# EAGLE design snap_v1 (EAGLE 7.6.0)
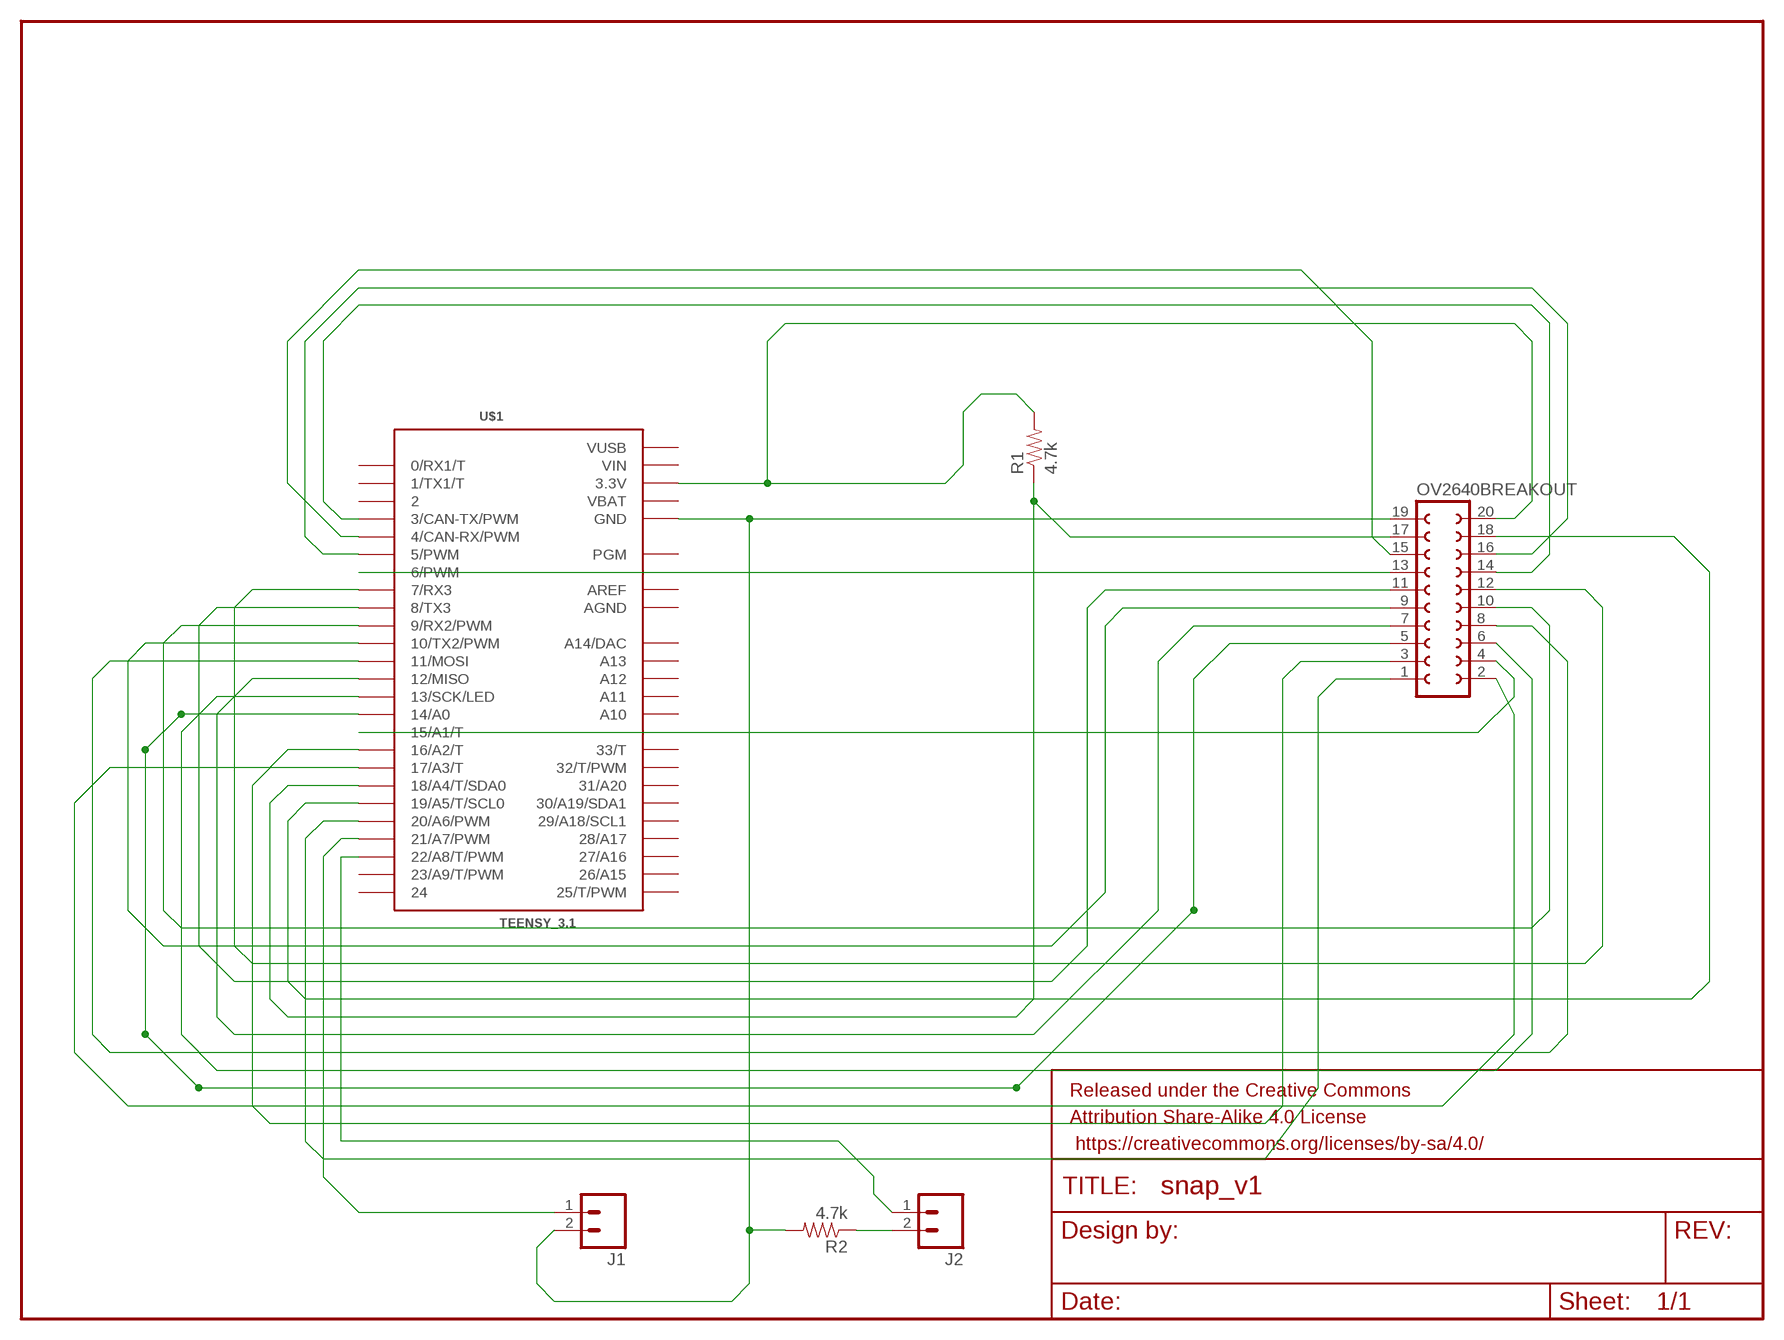
[diagram p0: schematic, sheet 1]

## Parts
FRAME1  FRAME-LETTER  [CREATIVE_COMMONS]
J1  M02PTH  [1X02]
J2  M02PTH  [1X02]
OV2640BREAKOUT  FE10-2  [FE10-2]
R1  4.7k  RESISTOREZ  [AXIAL-0.3EZ]
R2  4.7k  RESISTOREZ  [AXIAL-0.3EZ]
U$1  TEENSY_3.1  TEENSY_3.1-3.2_ALL_PINS&PADS  [TEENSY_3.0-3.2_ALL_PINS_&_PADS]

## Nets
D0: OV2640BREAKOUT.6 U$1.13(13/SCK/LED)
D1: OV2640BREAKOUT.5 U$1.14/A0
D2: OV2640BREAKOUT.8 U$1.11(11/MOSI)
D3: OV2640BREAKOUT.7 U$1.12(12/MISO)
D4: OV2640BREAKOUT.10 U$1.9(9/RX2/PWM)
D5: OV2640BREAKOUT.9 U$1.10(10/TX2/PWM)
D6: OV2640BREAKOUT.12 U$1.7(7/RX3)
D7: OV2640BREAKOUT.11 U$1.8(8/TX3)
HREF: OV2640BREAKOUT.16 U$1.5(5/PWM)
N$2: OV2640BREAKOUT.17 R1.P$1 U$1.18/A4(18/A4/T/SDA0)
N$3: J2.2 R2.P$1
PCLK: OV2640BREAKOUT.13 U$1.6(6/PWM)
PWDN: OV2640BREAKOUT.2 U$1.17/A3(17/A3/T)
RST: OV2640BREAKOUT.1 U$1.20/A6(20/A6/PWM)
SCLK: OV2640BREAKOUT.18 U$1.19/A5(19/A5/T/SCL0)
STATUSLED: J1.1 U$1.21/A7(21/A7/PWM)
STATUSLEDGND: J1.2 OV2640BREAKOUT.19 R2.P$2 U$1.GND U$1.GND1(GND) U$1.GND2(GND)
SWITCH: J2.1 U$1.22/A8(22/A8/T/PWM)
VCCPULLUP: OV2640BREAKOUT.20 R1.P$2 U$1.3.3V U$1.3.3V1(3.3V) U$1.3.3V2(3.3V)
VSYNC: OV2640BREAKOUT.15 U$1.4(4/CAN-RX/PWM)
XCLK: OV2640BREAKOUT.14 U$1.3(3/CAN-TX/PWM)
Y0: OV2640BREAKOUT.4 U$1.15/A1(15/A1/T)
Y1: OV2640BREAKOUT.3 U$1.16/A2(16/A2/T)
Unconnected: U$1.0(0/RX1/T) U$1.1(1/TX1/T) U$1.2 U$1.23/A9(23/A9/T/PWM) U$1.24 U$1.25(25/T/PWM) U$1.26(26/A15) U$1.27(27/A16) U$1.28(28/A17) U$1.29(29/A18/SCL1) U$1.30(30/A19/SDA1) U$1.31(31/A20) U$1.32(32/T/PWM) U$1.33(33/T) U$1.A10 U$1.A11 U$1.A12 U$1.A13 U$1.PGM U$1.RESET/DAC(A14/DAC)

## Power pins joined to a net without a drawn wire
AGND: U$1.AGND
AREF: U$1.AREF
VBAT: U$1.VBAT
VIN: U$1.VIN
VUSB: U$1.VUSB

## Library data of the parts
FRAME1 = SparkFun-Aesthetics:FRAME-LETTER: Schematic Frame Standard 8.5x11 US Letter frame
J1 J2 = SparkFun-Connectors:M02: Standard 2-pin 0.1" header. Use with - straight break away headers ( PRT-00116) - right angle break away headers (PRT-00553) - swiss pins (PRT-00743) - machine pins (PRT-00117) - female headers (PRT-00115) Molex polarized connector foot print use with: PRT-08233 with associated crimp pins and housings. 2.54_SCREWTERM for use with PRT-10571. 3.5mm Screw Terminal footprints for PRT-08084 5mm Screw Terminal footprints for use with PRT-08432
OV2640BREAKOUT = con-lsta:FE10-2: FEMALE HEADER; OC_FARNELL: unknown; OC_NEWARK: unknown
R1 R2 = SparkFun-Resistors:RESISTOR: Resistor Basic schematic elements and footprints for 0603, 1206, and PTH resistors.
U$1 = teensy:TEENSY_3.1-3.2_ALL_PINS&PADS: Footprint for Teensy 3.1 or 3.2 board using all pads and all through-holes. Pads need a 2x7 0.1" SMD header.

## Board
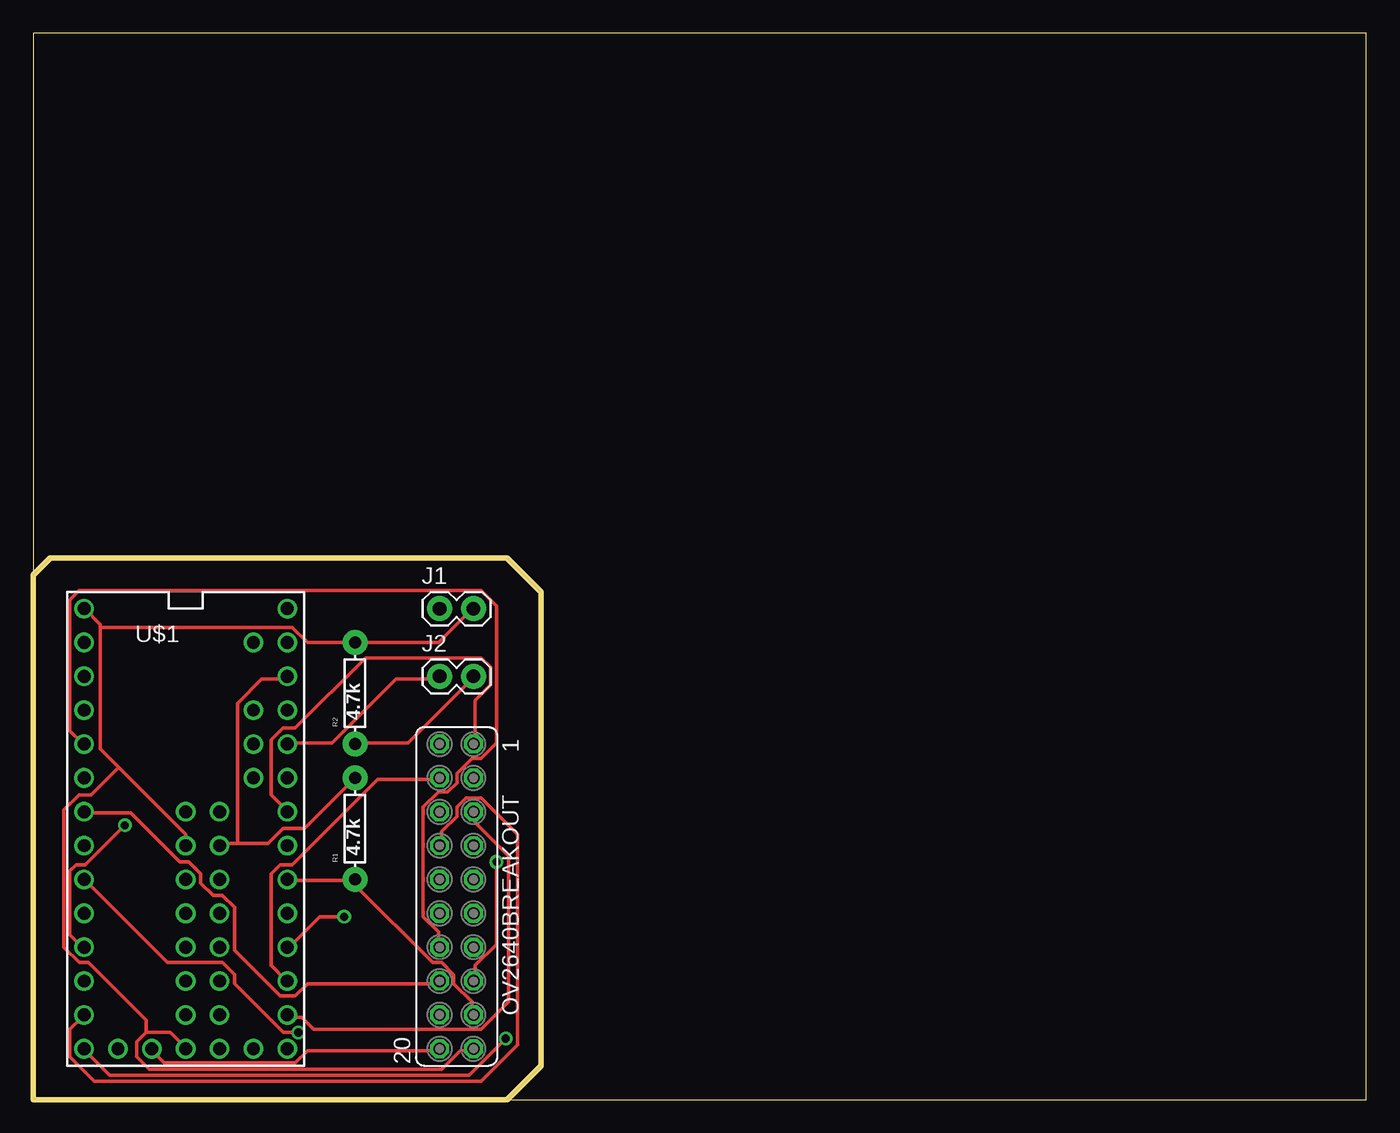
[diagram p1: board, top side]
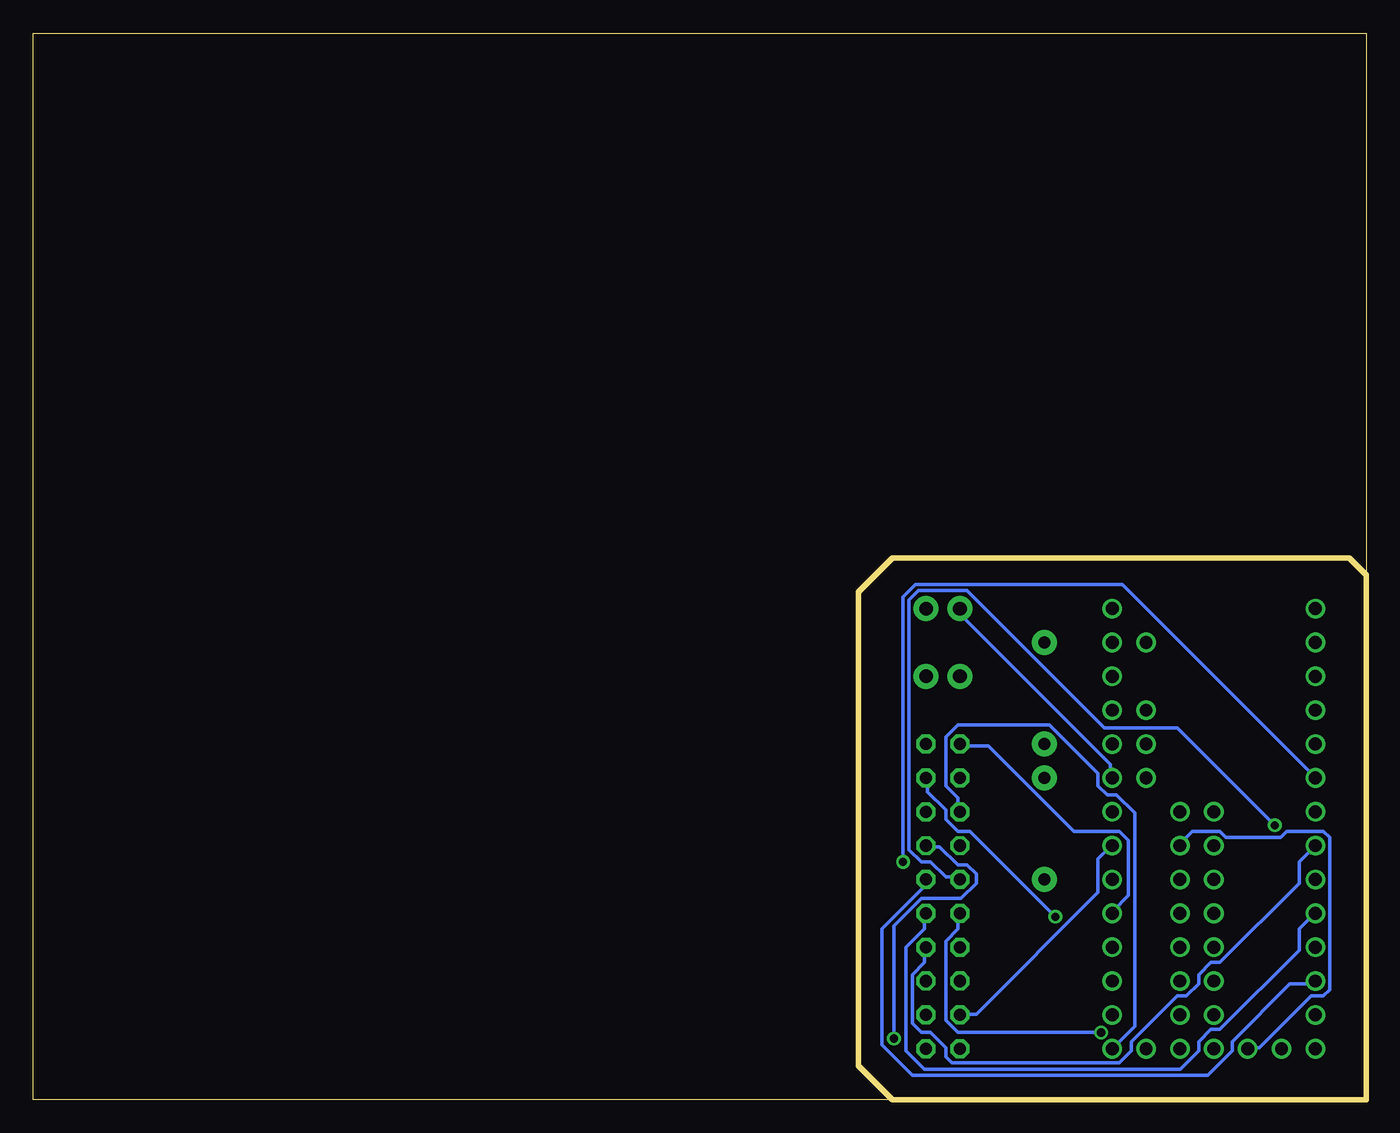
[diagram p2: board, bottom side, seen from below]

Size 100 x 80 mm. Coordinates in mm from the lower left corner, seen from the top.
Outline: 0,0 100,0 100,80 0,80 0,0
Copper layers (1*16): Top 0.035mm / dielectric 1.5mm / Bottom 0.035mm
Design rules "default": minimum track width 10mil, minimum drill 24mil, track to track 8mil, track to pad 8mil, pad to pad 8mil, via to via 8mil, smd to smd 8mil, copper to edge 40mil, drill to drill 8mil, minimum pad ring 10mil, minimum via ring 8mil, stop-mask expansion 4mil, vias tented up to drill 0mil, thermal gap 10mil

### Footprints (pad centres in the part's own frame; a part is rotated, then mirrored left to right if it is on the bottom)
1X02 = drill 1.016 pad 1.88: 1 0,0; 2 2.54,0
FE10-2 = drill 0.914 octagon: 1 -11.43,1.27; 2 -11.43,-1.27; 3 -8.89,1.27; 4 -8.89,-1.27; 5 -6.35,1.27; 6 -6.35,-1.27; 7 -3.81,1.27; 8 -3.81,-1.27; 9 -1.27,1.27; 10 -1.27,-1.27; 11 1.27,1.27; 12 1.27,-1.27; 13 3.81,1.27; 14 3.81,-1.27; 15 6.35,1.27; 16 6.35,-1.27; 17 8.89,1.27; 18 8.89,-1.27; 19 11.43,1.27; 20 11.43,-1.27
AXIAL-0.3EZ = drill 0.9 pad 1.88: P$1 -3.81,0; P$2 3.81,0
TEENSY_3.0-3.2_ALL_PINS_&_PADS = drill 0.965: 0 -7.62,13.97; 1 -7.62,11.43; 2 -7.62,8.89; 3 -7.62,6.35; 3.3V 7.62,11.43; 3.3V1 -2.54,-16.51; 3.3V2 2.54,-1.27; 4 -7.62,3.81; 5 -7.62,1.27; 6 -7.62,-1.27; 7 -7.62,-3.81; 8 -7.62,-6.35; 9 -7.62,-8.89; 10 -7.62,-11.43; 11 -7.62,-13.97; 12 -7.62,-16.51; 13 7.62,-16.51; 14/A0 7.62,-13.97; 15/A1 7.62,-11.43; 16/A2 7.62,-8.89; 17/A3 7.62,-6.35; 18/A4 7.62,-3.81; 19/A5 7.62,-1.27; 20/A6 7.62,1.27; 21/A7 7.62,3.81; 22/A8 7.62,6.35; 23/A9 7.62,8.89; 24 0,-3.81; 25 0,-6.35; 26 0,-8.89; 27 0,-11.43; 28 0,-13.97; 29 2.54,-13.97; 30 2.54,-11.43; 31 2.54,-8.89; 32 2.54,-6.35; 33 2.54,-3.81; A10 5.08,6.35; A11 5.08,3.81; A12 0,1.27; A13 2.54,1.27; AGND 7.62,13.97; AREF 5.08,8.89; GND -7.62,16.51; GND1 0,-16.51; GND2 0,-1.27; PGM 2.54,-16.51; RESET/DAC 5.08,-16.51; VBAT -5.08,-16.51; VIN 7.62,16.51; VUSB 5.08,13.97

### Placement (x,y rotation side)
FRAME1  -101.6,38.1 0 top  (outside the outline)
J1  30.48,36.83 0 top
J2  30.48,31.75 0 top
OV2640BREAKOUT  31.75,15.24 270 top
R1  24.13,20.32 90 top
R2  24.13,30.48 90 top
U$1  11.43,20.32 0 top

### Tracks (layer width: path | path; a pad name or v marks a point on that pad's centre or on a via)
D0
  Bottom 0.254: U$1.13 17.37,5.49 17.37,21.49 18.75,22.86 19.43,22.86 20.12,23.55 20.12,24.46 23.77,28.12 30.63,28.12 31.55,27.2 31.55,23.55 30.63,22.63 30.63,21.72 OV2640BREAKOUT.6
D1
  Top 0.254: OV2640BREAKOUT.5 33.15,21.49 33.15,20.8 35.66,18.29 35.66,7.32 33.6,5.26 21.03,5.26 20.12,6.17 19.2,6.17 U$1.14/A0
D2
  Top 0.254: OV2640BREAKOUT.8 30.63,19.2 30.63,20.12 31.77,21.26 31.77,21.95 32.46,22.63 33.6,22.63 36.35,19.89 36.35,4.12 33.6,1.37 4.57,1.37 2.74,3.2 2.74,5.26 3.66,6.17 U$1.11
D3  (via drill 0.61)
  Top 0.254: v35.43,4.57 32.69,1.83 5.71,1.83 3.89,3.66 U$1.12
  Bottom 0.254: v35.43,4.57 35.43,13.03 33.38,15.09 30.4,15.09 29.26,16.23 29.26,16.92 29.95,17.6 30.63,17.6 32,18.97 32.92,18.97 OV2640BREAKOUT.7
D4  (via drill 0.61)
  Top 0.254: v6.86,20.57 3.89,17.6 3.2,17.6 2.74,17.14 2.74,12.34 3.66,11.43 U$1.9
  Bottom 0.254: v6.86,20.57 14.17,27.89 19.66,27.89 29.95,38.18 33.6,38.18 34.29,37.49 34.29,18.75 33.38,17.83 32.69,17.83 31.55,16.69 30.63,16.69 OV2640BREAKOUT.10
D5
  Bottom 0.254: OV2640BREAKOUT.9 33.15,16.46 33.15,16 36.35,12.8 36.35,4.12 34.06,1.83 11.89,1.83 10.06,3.66 10.06,4.34 5.71,8.69 3.89,8.69 U$1.10
D6  (via drill 0.61)
  Top 0.254: v19.89,5.03 18.75,5.03 15.09,8.69 15.09,9.37 14.17,10.29 10.06,10.29 3.89,16.46 U$1.7
  Bottom 0.254: v19.89,5.03 30.63,5.03 31.55,5.94 31.55,11.89 30.63,12.8 30.63,13.95 OV2640BREAKOUT.12
D7
  Bottom 0.254: OV2640BREAKOUT.11 33.15,13.95 33.15,12.8 34.52,11.43 34.52,3.66 33.15,2.29 13.95,2.29 12.57,3.66 12.57,4.34 11.66,5.26 10.97,5.26 5.03,11.2 5.03,12.8 3.89,13.95 U$1.8
HREF
  Top 0.254: OV2640BREAKOUT.16 30.4,8.69 20.57,8.69 19.66,7.77 18.52,7.77 15.09,11.2 15.09,14.4 14.17,15.32 13.49,15.32 12.57,16.23 12.57,16.92 11.66,17.83 10.97,17.83 7.32,21.49 3.89,21.49 U$1.5
N$2
  Top 0.254: OV2640BREAKOUT.17 32.92,6.4 32.92,7.32 31.55,8.69 31.55,9.37 30.63,10.29 29.95,10.29 24.23,16 24.23,16.46 R1.P$1 24,16.46 19.2,16.46 U$1.18/A4
N$3
  Top 0.254: R2.P$1 24.23,26.75 28.12,26.75 32.92,31.55 J2.2
PCLK
  Bottom 0.254: U$1.6 5.03,17.83 5.03,16.23 10.97,10.29 11.66,10.29 12.57,9.37 12.57,8.69 13.49,7.77 14.17,7.77 17.6,4.34 17.6,3.66 18.52,2.74 31.09,2.74 31.55,3.2 31.55,3.89 32.69,5.03 33.38,5.03 34.06,5.71 34.06,9.37 33.15,10.29 33.15,11.43 OV2640BREAKOUT.13
PWDN
  Bottom 0.254: OV2640BREAKOUT.2 30.4,26.52 28.35,26.52 21.95,20.12 18.52,20.12 17.83,19.43 17.83,15.32 18.97,14.17 U$1.17/A3
RST
  Top 0.254: OV2640BREAKOUT.1 33.15,26.75 33.15,29.95 34.29,31.09 34.29,32.46 33.6,33.15 24.92,33.15 19.66,27.89 18.75,27.89 17.83,26.98 17.83,22.86 18.97,21.72 U$1.20/A6
S$1
  pour Bottom: 0,0 0,39.37 1.27,40.64 2.54,40.64 35.56,40.64 38.1,38.1 38.1,2.54 35.56,0
SCLK
  Bottom 0.254: OV2640BREAKOUT.18 30.4,6.4 29.26,6.4 20.12,15.54 20.12,18.06 19.2,18.97 U$1.19/A5
STATUSLED
  Bottom 0.254: U$1.21/A7 19.2,24.23 19.2,25.15 30.4,36.35 30.4,36.8 J1.1
STATUSLEDGND
  Top 0.254: 8.46,5.03 7.77,4.34 7.77,3.2 8.69,2.29 30.63,2.29 32,3.66 32.92,3.66 OV2640BREAKOUT.19 | 8.46,5.03 10.29,5.03 11.43,3.89 U$1.GND1 | J1.2 32.92,36.8 30.4,34.29 R2.P$2 20.57,34.29 19.43,35.43 5.03,35.43 | U$1.GND2 11.43,19.89 6.4,24.92 | 6.4,24.92 5.03,26.29 5.03,35.43 | 5.03,35.43 5.03,35.66 3.89,36.8 U$1.GND | 8.46,5.03 8.46,5.94 4.12,10.29 3.43,10.29 2.29,11.43 2.29,21.72 3.43,22.86 4.34,22.86 6.4,24.92
SWITCH
  Top 0.254: U$1.22/A8 19.2,26.75 22.4,26.75 27.2,31.55 30.4,31.55 J2.1
VCCPULLUP
  Top 0.254: OV2640BREAKOUT.20 30.4,3.66 20.57,3.66 19.66,2.74 9.83,2.74 8.91,3.66 U$1.3.3V1 | 15.32,19.2 17.6,19.2 18.75,20.34 20.34,20.34 R1.P$2 | 15.32,19.2 14.17,19.2 U$1.3.3V2 | 15.32,19.2 15.32,29.72 17.14,31.55 18.97,31.55 U$1.3.3V
  Bottom 0.254: U$1.3.3V1 8.69,3.89 8,3.89 4.12,7.77 3.2,7.77 2.74,8.23 2.74,19.66 3.2,20.12 5.94,20.12 6.4,19.66 10.52,19.66 10.97,20.12 13.03,20.12 13.95,19.2 U$1.3.3V2
VSYNC  (via drill 0.61)
  Top 0.254: v34.75,17.83 34.75,11.66 33.15,10.06 33.15,8.91 OV2640BREAKOUT.15
  Bottom 0.254: v34.75,17.83 34.75,37.72 33.83,38.63 18.29,38.63 3.89,24.23 U$1.4
XCLK
  Top 0.254: OV2640BREAKOUT.14 30.4,11.43 30.4,12.57 29.26,13.72 29.26,21.95 30.4,23.09 31.09,23.09 31.77,23.77 31.77,24.46 32.92,25.6 33.6,25.6 34.75,26.75 34.75,37.03 33.6,38.18 3.43,38.18 2.74,37.49 2.74,27.66 3.66,26.75 U$1.3
Y0
  Top 0.254: OV2640BREAKOUT.4 30.4,24 25.83,24 19.43,17.6 18.52,17.6 17.83,16.92 17.83,10.06 18.97,8.91 U$1.15/A1
Y1  (via drill 0.61)
  Top 0.254: v23.32,13.72 21.49,13.72 19.2,11.43 U$1.16/A2
  Bottom 0.254: v23.32,13.72 29.72,20.12 30.63,20.12 31.55,21.03 31.55,21.72 32.92,23.09 32.92,24 OV2640BREAKOUT.3